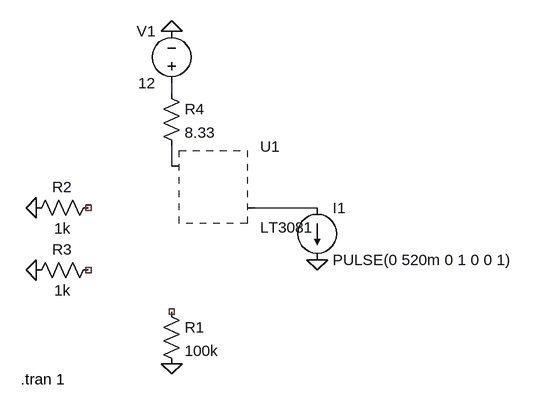
[diagram p0: schematic Draft1.asc]
Draft1.asc, the LTspice schematic file:
Version 4
SHEET 1 880 680
WIRE 176 -48 176 -64
WIRE 176 64 176 32
WIRE 400 128 304 128
FLAG -32 128 0
FLAG -32 224 0
FLAG 176 -144 0
FLAG 176 368 0
FLAG 400 208 0
SYMBOL PowerProducts\\LT3081 176 176 R0
SYMATTR InstName U1
SYMBOL voltage 176 -48 R180
WINDOW 0 24 96 Left 2
WINDOW 3 24 16 Left 2
WINDOW 123 0 0 Left 0
WINDOW 39 0 0 Left 0
SYMATTR InstName V1
SYMATTR Value 12
SYMBOL res 160 272 R0
SYMATTR InstName R1
SYMATTR Value 100k
SYMBOL res 64 112 R90
WINDOW 0 0 56 VBottom 2
WINDOW 3 32 56 VTop 2
SYMATTR InstName R2
SYMATTR Value 1k
SYMBOL res 64 208 R90
WINDOW 0 0 56 VBottom 2
WINDOW 3 32 56 VTop 2
SYMATTR InstName R3
SYMATTR Value 1k
SYMBOL res 160 -64 R0
SYMATTR InstName R4
SYMATTR Value 8.33
SYMBOL current 400 128 R0
WINDOW 123 0 0 Left 0
WINDOW 39 0 0 Left 0
SYMATTR InstName I1
SYMATTR Value PULSE(0 520m 0 1 0 0 1)
TEXT -56 392 Left 2 !.tran 1

The netlist it stands for:
* Draft1.asc
* U1: LT3081 (symbol PowerProducts\LT3081 not available, pin order unknown); nets seen at it: N002, N003
V1 N001 0 12
R1 NC_01 0 100k
R2 NC_02 0 1k
R3 NC_03 0 1k
R4 N001 N002 8.33
I1 N003 0 PULSE(0 520m 0 1 0 0 1)
.tran 1
.backanno
.end